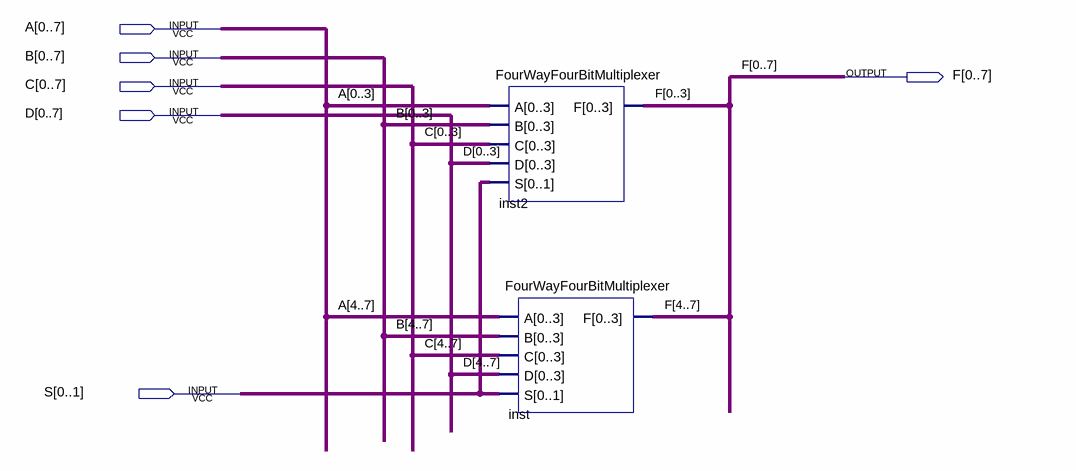
[diagram p0: schematic sheet]
// Quartus schematic FourWayEightBitMultiplexer.bdf as structural Verilog: 2 symbols, 6 pins
module FourWayEightBitMultiplexer (
  input  [0:7] A,
  input  [0:7] B,
  input  [0:7] C,
  input  [0:7] D,
  input  [0:1] S,
  output [0:7] F
);

  FourWayFourBitMultiplexer inst2 (.A(A[0:3]), .B(B[0:3]), .C(C[0:3]), .D(D[0:3]), .S(S), .F(F[0:3]));
  FourWayFourBitMultiplexer inst (.A(A[4:7]), .B(B[4:7]), .C(C[4:7]), .D(D[4:7]), .S(S), .F(F[4:7]));
endmodule
